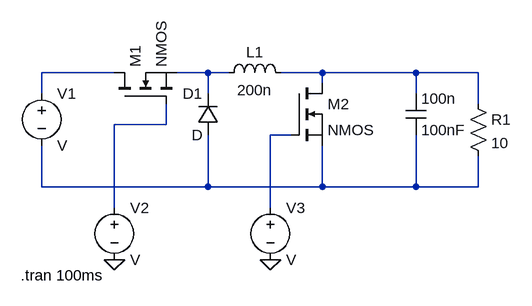
[diagram p0: schematic Draft4.asc]
Draft4.asc, the LTspice schematic file:
Version 4
SHEET 1 880 680
WIRE -128 96 -240 96
WIRE 16 96 -32 96
WIRE 48 96 16 96
WIRE 192 96 128 96
WIRE 336 96 192 96
WIRE 432 96 336 96
WIRE 192 112 192 96
WIRE -240 128 -240 96
WIRE 16 128 16 96
WIRE 336 128 336 96
WIRE 432 144 432 96
WIRE -48 176 -48 144
WIRE -48 176 -128 176
WIRE 144 192 112 192
WIRE -240 272 -240 208
WIRE 16 272 16 192
WIRE 16 272 -240 272
WIRE 192 272 192 208
WIRE 192 272 16 272
WIRE 336 272 336 192
WIRE 336 272 192 272
WIRE 432 272 432 224
WIRE 432 272 336 272
WIRE -128 304 -128 176
WIRE 112 304 112 192
FLAG -128 384 0
FLAG 112 384 0
SYMBOL diode 32 192 R180
WINDOW 0 24 64 Left 2
WINDOW 3 24 0 Left 2
SYMATTR InstName D1
SYMBOL nmos -128 144 R270
SYMATTR InstName M1
SYMBOL nmos 144 112 R0
SYMATTR InstName M2
SYMBOL ind 32 112 R270
WINDOW 0 32 56 VTop 2
WINDOW 3 5 56 VBottom 2
SYMATTR InstName L1
SYMATTR Value 200n
SYMBOL cap 320 128 R0
SYMATTR InstName 100n
SYMATTR Value 100nF
SYMBOL voltage -240 112 R0
SYMATTR InstName V1
SYMBOL voltage -128 288 R0
SYMATTR InstName V2
SYMBOL voltage 112 288 R0
SYMATTR InstName V3
SYMBOL res 416 128 R0
SYMATTR InstName R1
SYMATTR Value 10
TEXT -272 408 Left 2 !.tran 100ms

The netlist it stands for:
* Draft4.asc
D1 N006 N002 D
M1 N001 N004 N002 N002 NMOS
M2 N003 N005 N006 N006 NMOS
L1 N002 N003 200n
C§100n N003 N006 100nF
V1 N001 N006 V
V2 N004 0 V
V3 N005 0 V
R1 N003 N006 10
.model D D
.lib standard.dio
.model NMOS NMOS
.model PMOS PMOS
.lib standard.mos
.tran 100ms
.backanno
.end